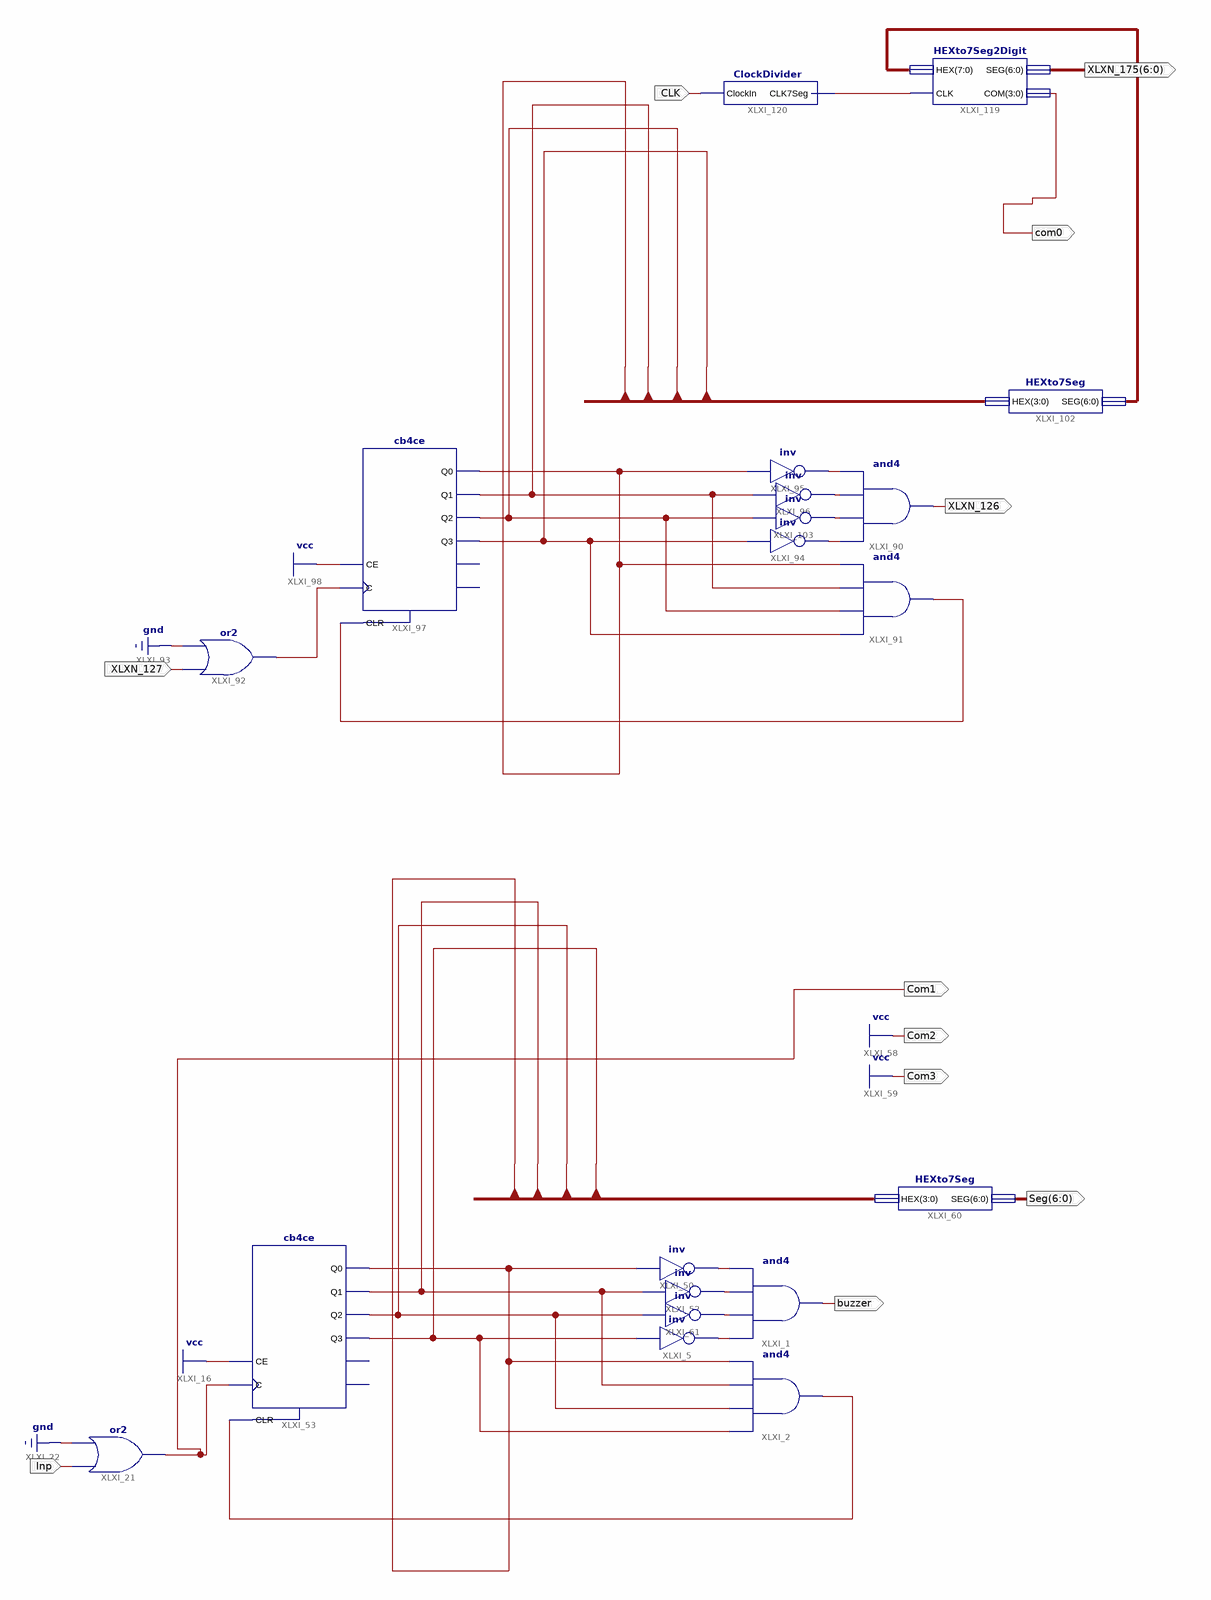
[diagram p0: schematic sheet 1]
// Xilinx ISE schematic main.sch (spartan6) as structural Verilog: 20 symbols, 11 ports
module main (
  input  XLXN_127,
  input  Inp,
  input  CLK,
  output XLXN_126,
  output buzzer,
  output [6:0] Seg,
  output Com1,
  output Com2,
  output Com3,
  output com0,
  output [6:0] XLXN_175
);

  wire XLXN_4, XLXN_44, XLXN_63, XLXN_65, XLXN_72, XLXN_125, XLXN_131, XLXN_137, XLXN_138, XLXN_147, XLXN_177;
  wire [3:0] BCD, XLXN_129;
  wire [6:0] seg0;

  and XLXI_90 (XLXN_126, XLXN_131, XLXN_147, XLXN_138, XLXN_137);
  and XLXI_91 (XLXN_125, XLXN_129[3], XLXN_129[2], XLXN_129[1], XLXN_129[0]);
  or XLXI_92 (com0, XLXN_127, 1'b0);
  not XLXI_94 (XLXN_131, XLXN_129[3]);
  not XLXI_95 (XLXN_137, XLXN_129[0]);
  not XLXI_96 (XLXN_138, XLXN_129[1]);
  cb4ce XLXI_97 (
    .C(com0), .CE(1'b1), .CLR(XLXN_125), .Q0(XLXN_129[0]), .Q1(XLXN_129[1]), .Q2(XLXN_129[2]),
    .Q3(XLXN_129[3]));  // open: CEO, TC
  HEXto7Seg XLXI_102 (.HEX(XLXN_129), .SEG(seg0));
  not XLXI_103 (XLXN_147, XLXN_129[2]);
  and XLXI_1 (buzzer, XLXN_44, XLXN_72, XLXN_65, XLXN_63);
  and XLXI_2 (XLXN_4, BCD[3], BCD[2], BCD[1], BCD[0]);
  or XLXI_21 (Com1, Inp, 1'b0);
  not XLXI_5 (XLXN_44, BCD[3]);
  not XLXI_50 (XLXN_63, BCD[0]);
  not XLXI_52 (XLXN_65, BCD[1]);
  cb4ce XLXI_53 (
    .C(Com1), .CE(1'b1), .CLR(XLXN_4), .Q0(BCD[0]), .Q1(BCD[1]), .Q2(BCD[2]), .Q3(BCD[3]));  // open: CEO, TC
  not XLXI_61 (XLXN_72, BCD[2]);
  HEXto7Seg XLXI_60 (.HEX(BCD), .SEG(Seg));
  HEXto7Seg2Digit XLXI_119 (.HEX(seg0), .CLK(XLXN_177), .SEG(XLXN_175), .COM({4{com0}}));
  ClockDivider XLXI_120 (.ClockIn(CLK), .CLK7Seg(XLXN_177));

  assign Com2 = 1'b1;
  assign Com3 = 1'b1;
endmodule
